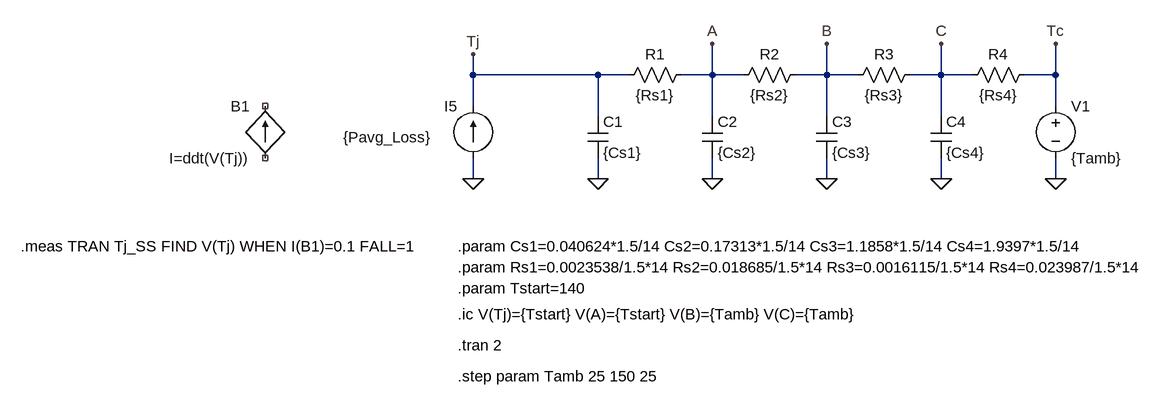
[diagram p0: schematic ThermalApproxRC.asc]
ThermalApproxRC.asc, the LTspice schematic file:
Version 4
SHEET 1 1328 680
WIRE 48 48 48 16
WIRE 240 48 48 48
WIRE 288 48 240 48
WIRE 416 48 416 0
WIRE 416 48 368 48
WIRE 464 48 416 48
WIRE 592 48 592 0
WIRE 592 48 544 48
WIRE 640 48 592 48
WIRE 768 48 768 0
WIRE 768 48 720 48
WIRE 816 48 768 48
WIRE 944 48 944 0
WIRE 944 48 896 48
WIRE 48 96 48 48
WIRE 944 96 944 48
WIRE 240 112 240 48
WIRE 416 112 416 48
WIRE 592 112 592 48
WIRE 768 112 768 48
WIRE 48 208 48 176
WIRE 240 208 240 176
WIRE 416 208 416 176
WIRE 592 208 592 176
WIRE 768 208 768 176
WIRE 944 208 944 176
FLAG 48 16 Tj
FLAG 240 208 0
FLAG 416 208 0
FLAG 592 208 0
FLAG 768 208 0
FLAG 944 0 Tc
FLAG 944 208 0
FLAG 416 0 A
FLAG 592 0 B
FLAG 768 0 C
FLAG 48 208 0
SYMBOL cap 224 112 R0
SYMATTR InstName C1
SYMATTR Value {Cs1}
SYMBOL cap 400 112 R0
SYMATTR InstName C2
SYMATTR Value {Cs2}
SYMBOL res 384 32 R90
WINDOW 0 0 56 VBottom 2
WINDOW 3 32 56 VTop 2
SYMATTR InstName R1
SYMATTR Value {Rs1}
SYMBOL cap 576 112 R0
SYMATTR InstName C3
SYMATTR Value {Cs3}
SYMBOL res 560 32 R90
WINDOW 0 0 56 VBottom 2
WINDOW 3 32 56 VTop 2
SYMATTR InstName R2
SYMATTR Value {Rs2}
SYMBOL cap 752 112 R0
SYMATTR InstName C4
SYMATTR Value {Cs4}
SYMBOL res 736 32 R90
WINDOW 0 0 56 VBottom 2
WINDOW 3 32 56 VTop 2
SYMATTR InstName R3
SYMATTR Value {Rs3}
SYMBOL res 912 32 R90
WINDOW 0 0 56 VBottom 2
WINDOW 3 32 56 VTop 2
SYMATTR InstName R4
SYMATTR Value {Rs4}
SYMBOL voltage 944 80 R0
WINDOW 123 0 0 Left 0
WINDOW 39 0 0 Left 0
SYMATTR InstName V1
SYMATTR Value {Tamb}
SYMBOL current 48 176 R180
WINDOW 0 24 80 Left 2
WINDOW 3 64 32 Left 2
WINDOW 123 0 0 Left 0
WINDOW 39 0 0 Left 0
SYMATTR InstName I5
SYMATTR Value {Pavg_Loss}
SYMBOL bi -272 176 R180
WINDOW 0 24 80 Left 2
WINDOW 3 24 0 Left 2
SYMATTR InstName B1
SYMATTR Value I=ddt(V(Tj))
TEXT 24 312 Left 2 !.param Cs1=0.040624*1.5/14 Cs2=0.17313*1.5/14 Cs3=1.1858*1.5/14 Cs4=1.9397*1.5/14
TEXT 24 344 Left 2 !.param Rs1=0.0023538/1.5*14 Rs2=0.018685/1.5*14 Rs3=0.0016115/1.5*14 Rs4=0.023987/1.5*14
TEXT 24 464 Left 2 !.tran 2
TEXT -648 312 Left 2 !.meas TRAN Tj_SS FIND V(Tj) WHEN I(B1)=0.1 FALL=1
TEXT 24 512 Left 2 !.step param Tamb 25 150 25
TEXT 24 416 Left 2 !.ic V(Tj)={Tstart} V(A)={Tstart} V(B)={Tamb} V(C)={Tamb}
TEXT 24 376 Left 2 !.param Tstart=140

The netlist it stands for:
* ThermalApproxRC.asc
C1 Tj 0 {Cs1}
C2 A 0 {Cs2}
R1 A Tj {Rs1}
C3 B 0 {Cs3}
R2 B A {Rs2}
C4 C 0 {Cs4}
R3 C B {Rs3}
R4 Tc C {Rs4}
V1 Tc 0 {Tamb}
I5 0 Tj {Pavg_Loss}
B1 NC_01 NC_02 I=ddt(V(Tj))
.param Cs1=0.040624*1.5/14 Cs2=0.17313*1.5/14 Cs3=1.1858*1.5/14 Cs4=1.9397*1.5/14
.param Rs1=0.0023538/1.5*14 Rs2=0.018685/1.5*14 Rs3=0.0016115/1.5*14 Rs4=0.023987/1.5*14
.tran 2
.meas TRAN Tj_SS FIND V(Tj) WHEN I(B1)=0.1 FALL=1
.step param Tamb 25 150 25
.ic V(Tj)={Tstart} V(A)={Tstart} V(B)={Tamb} V(C)={Tamb}
.param Tstart=140
.backanno
.end